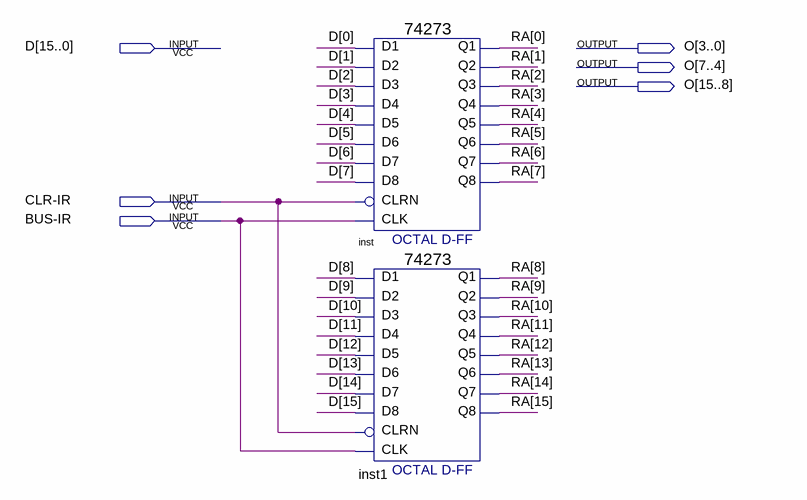
[diagram p0: schematic sheet]
// Quartus schematic IR.bdf as structural Verilog: 2 symbols, 6 pins
module IR (
  input  [15:0] D,
  input  \CLR-IR ,
  input  \BUS-IR ,
  output [15:0] O
);

  wire [15:0] RA;

  \74273  inst (
    .D2(D[1]), .D3(D[2]), .D1(D[0]), .D4(D[3]), .D7(D[6]), .D6(D[5]), .D5(D[4]), .D8(D[7]), .CLK(\BUS-IR ),
    .CLRN(\CLR-IR ), .Q4(RA[3]), .Q1(RA[0]), .Q2(RA[1]), .Q3(RA[2]), .Q6(RA[5]), .Q5(RA[4]), .Q7(RA[6]),
    .Q8(RA[7]));
  \74273  inst1 (
    .D2(D[9]), .D3(D[10]), .D1(D[8]), .D4(D[11]), .D7(D[14]), .D6(D[13]), .D5(D[12]), .D8(D[15]),
    .CLK(\BUS-IR ), .CLRN(\CLR-IR ), .Q4(RA[11]), .Q1(RA[8]), .Q2(RA[9]), .Q3(RA[10]), .Q6(RA[13]),
    .Q5(RA[12]), .Q7(RA[14]), .Q8(RA[15]));
endmodule
